# Altium schematic sheet SOLAR CHARGER.SchDoc
size A3; SheetNumber: 1; SheetTotal: 1
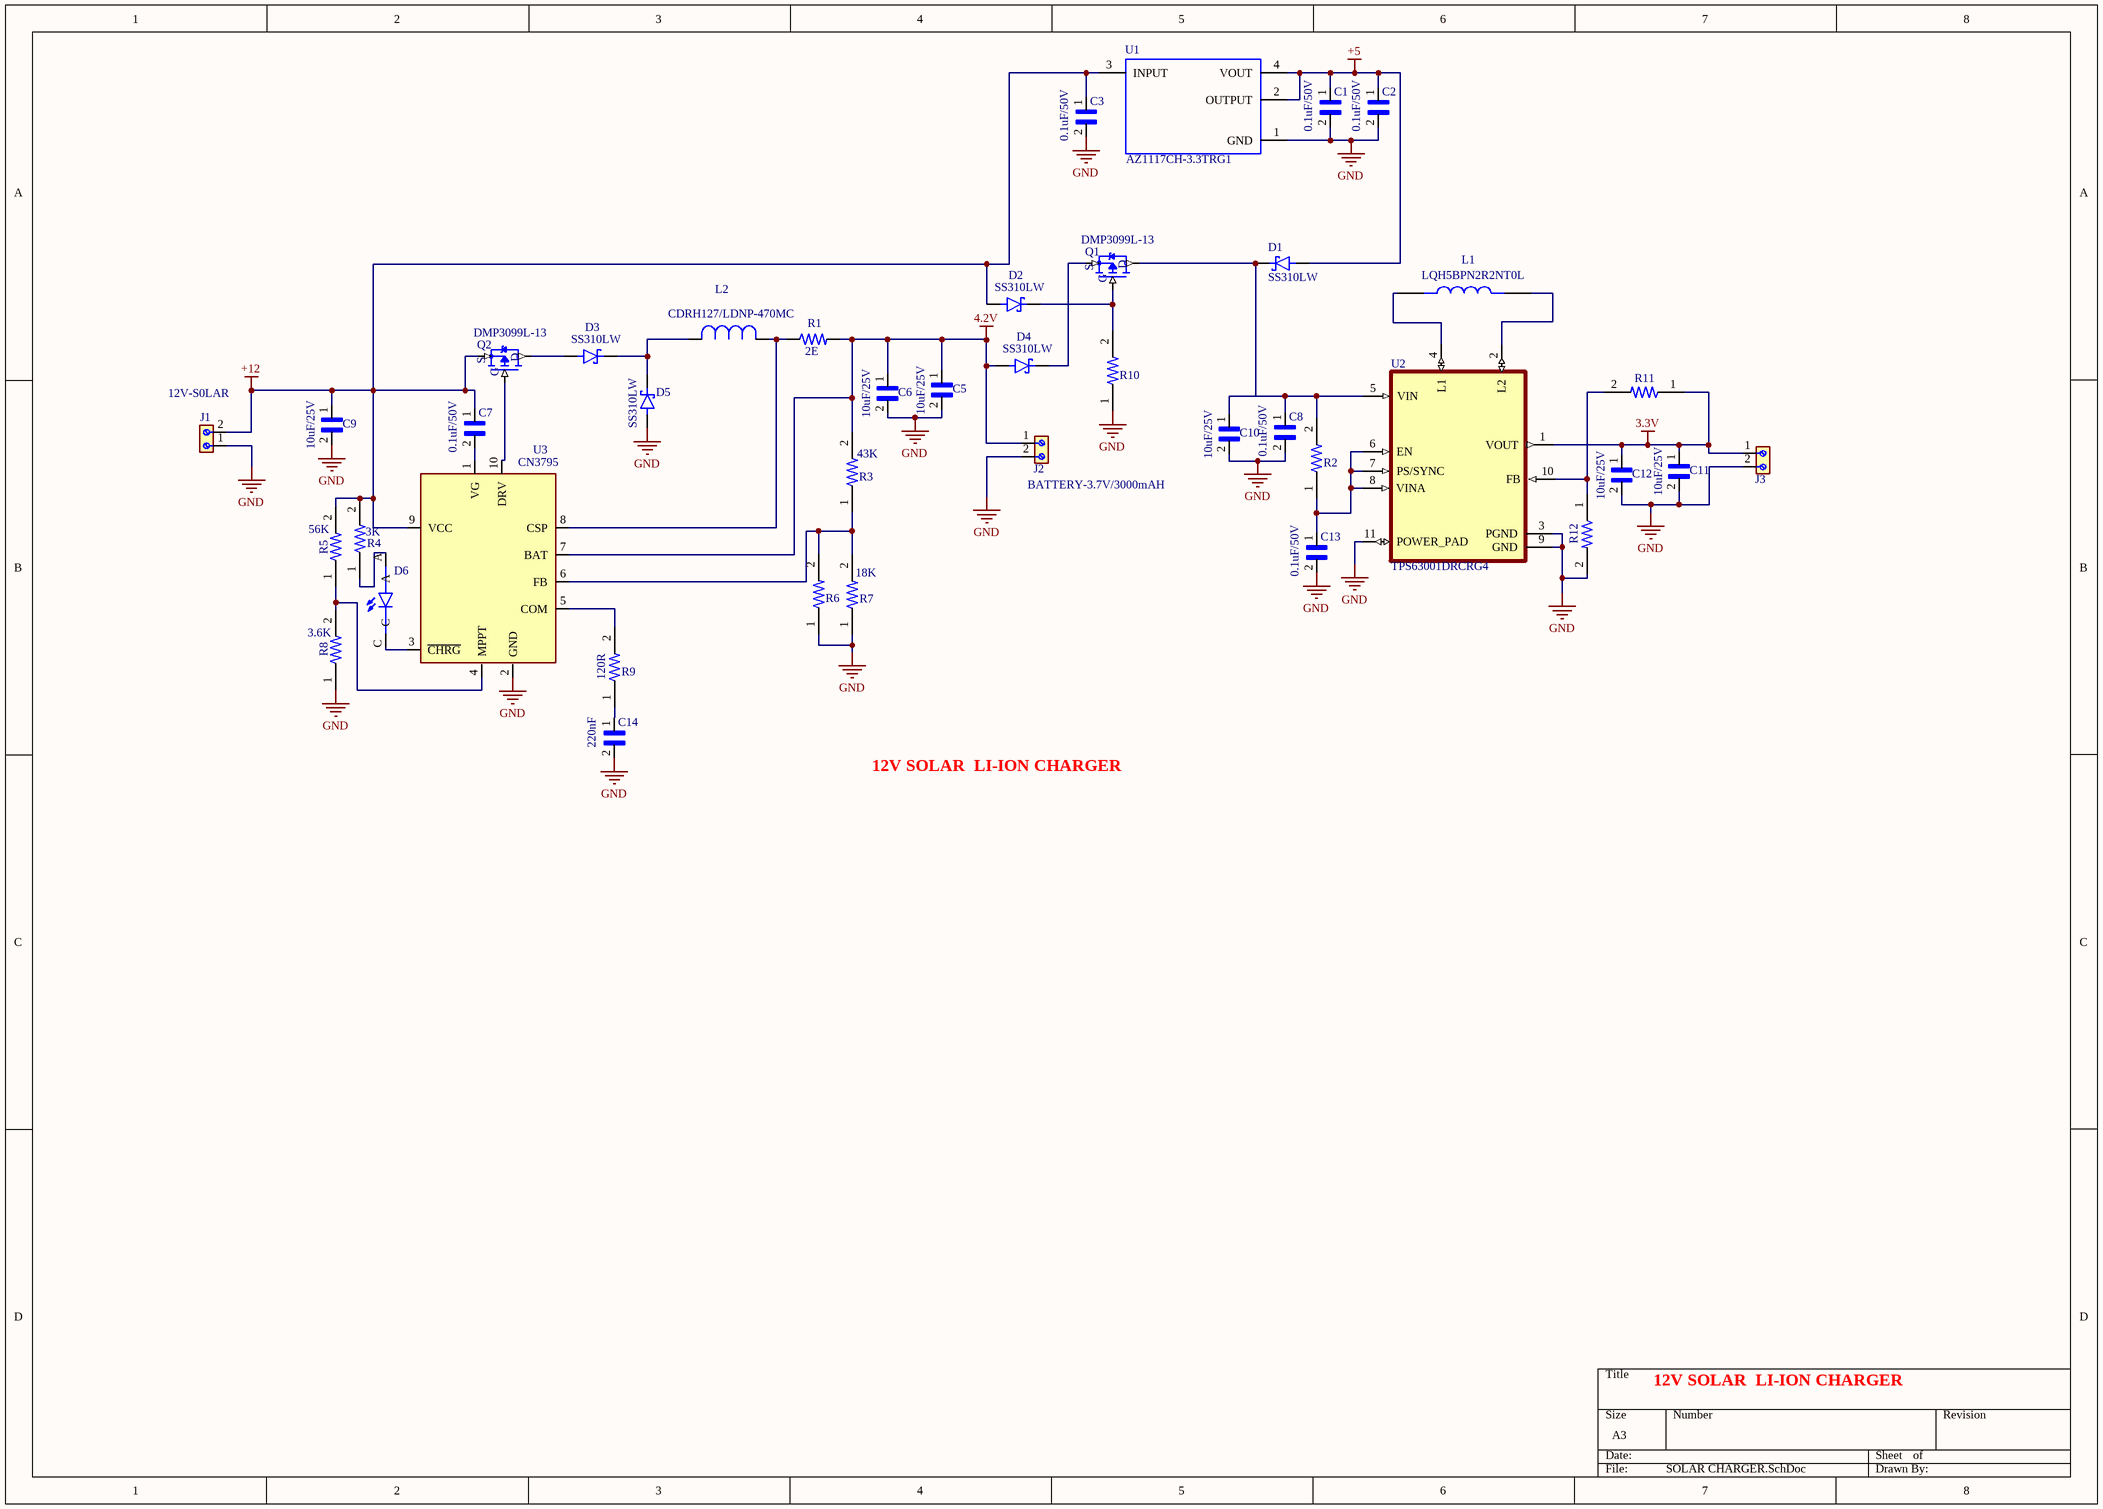
[diagram p0: SOLAR CHARGER.SchDoc]

## Parts
C1  value 0.1uF/50V  [CAPC1608X90]  (hidden comment: CC0603KRX5R5BB106)
C2  value 0.1uF/50V  [CAPC1608X90]  (hidden comment: CC0603KRX5R5BB106)
C3  value 0.1uF/50V  [CAPC1608X90]  (hidden comment: CC0603KRX5R5BB106)
C5  value 10uF/25V  [CAPC1608X100N]  (hidden comment: GRM188R61E106MA73J)
C6  value 10uF/25V  [CAPC1608X100N]  (hidden comment: GRM188R61E106MA73J)
C7  value 0.1uF/50V  [CAPC1608X90]  (hidden comment: CC0603KRX5R5BB106)
C8  value 0.1uF/50V  [CAPC1608X90]  (hidden comment: CC0603KRX5R5BB106)
C9  value 10uF/25V  [CAPC1608X100N]  (hidden comment: GRM188R61E106MA73J)
C10  value 10uF/25V  [CAPC1608X100N]  (hidden comment: GRM188R61E106MA73J)
C11  value 10uF/25V  [CAPC1608X100N]  (hidden comment: GRM188R61E106MA73J)
C12  value 10uF/25V  [CAPC1608X100N]  (hidden comment: GRM188R61E106MA73J)
C13  value 0.1uF/50V  [CAPC1608X90]  (hidden comment: CC0603KRX5R5BB106)
C14  value 220nF  [CAPC1608X90]  (hidden comment: CC0603KRX5R5BB106)
D1  SS310LW  [SODFL3718X102N]
D2  SS310LW  [SODFL3718X102N]
D3  SS310LW  [SODFL3718X102N]
D4  SS310LW  [SODFL3718X102N]
D5  SS310LW  [SODFL3718X102N]
D6  597-3305-607F  [LEDC2012X70N]  (value not drawn)
J1  691210910002  [691210910002]  (value not drawn)
J2  691210910002  [691210910002]  (value not drawn)
J3  691210910002  [691210910002]  (value not drawn)
L1  LQH5BPN2R2NT0L  [IND_LQH5BPN2R2NT0L]
L2  CDRH127/LDNP-470MC  [IND_CDRH127/LDNP-470MC_SUM]
Q1  DMP3099L-13  [SOT95P240X110-3N]
Q2  DMP3099L-13  [SOT95P240X110-3N]
R1  value 2E  [RESC5025X70N]  (hidden comment: 2-2176251-7)
R2  RCWP040210K0FKS3  [RESC1005X40]  (value not drawn)
R3  value 43K  [RESC1005X40]  (hidden comment: RCWP040210K0FKS3)
R4  value 3K  [RESC1005X40]  (hidden comment: RCWP040210K0FKS3)
R5  value 56K  [RESC1005X40]  (hidden comment: RCWP040210K0FKS3)
R6  RCWP040210K0FKS3  [RESC1005X40]  (value not drawn)
R7  value 18K  [RESC1005X40]  (hidden comment: RCWP040210K0FKS3)
R8  value 3.6K  [RESC1005X40]  (hidden comment: RCWP040210K0FKS3)
R9  value 120R  [RESC1005X40]  (hidden comment: RCWP040210K0FKS3)
R10  RCWP040210K0FKS3  [RESC1005X40]  (value not drawn)
R11  RCWP040210K0FKS3  [RESC1005X40]  (value not drawn)
R12  RCWP040210K0FKS3  [RESC1005X40]  (value not drawn)
U1  AZ1117CH-3.3TRG1  [DIODES_AZ1117CH-3.3TRG1_0]  (value not drawn)
U2  TPS63001DRCRG4  [VREG_V62/16624-01YE]
U3  CN3795  [SSOP10]

## Nets
3.3V: C11.1 C12.1 J3.1 R11.1 U2.1(VOUT)
4.2V: C5.1 C6.1 D4.A J2.1 R1.2 R3.2 U3.7(BAT)
+5: C1.1 C2.1 D1.A U1.2(OUTPUT) U1.4(VOUT)
+12: C3.1 C7.1 C9.1 D2.A J1.2 Q2.2(S) R4.2 R5.2 U1.3(INPUT) U3.9(VCC)
GND: C1.2 C2.2 C3.2 C5.2 C6.2 C8.2 C9.2 C10.2 C11.2 C12.2 C13.2 C14.2 D5.A J1.1 J2.2 J3.2 R6.1 R7.1 R8.1 R10.1 R12.2 U1.1(GND) U2.3(PGND) U2.9(GND) U2.11(POWER_PAD) U3.2(GND)
NetC7_2: C7.2 U3.1(VG)
NetC8_1: C8.1 C10.1 R2.2 U2.5(VIN)
NetC13_1: C13.1 R2.1 U2.6(EN) U2.7(PS/SYNC) U2.8(VINA)
NetC14_1: C14.1 R9.1
NetD1_C: D1.C(K) Q1.3(D)
NetD2_C: D2.C(K) Q1.1(G) R10.2
NetD3_A: D3.A Q2.3(D)
NetD3_C: D3.C(K) D5.C(K) L2.2
NetD4_C: D4.C(K) Q1.2(S)
NetD6_A: D6.A R4.1
NetD6_C: D6.C U3.3(~{CHRG})
NetL1_1: L1.1 U2.4(L1)
NetL1_2: L1.2 U2.2(L2)
NetL2_1: L2.1 R1.1 U3.8(CSP)
NetQ2_1: Q2.1(G) U3.10(DRV)
NetR3_1: R3.1 R6.2 R7.2 U3.6(FB)
NetR5_1: R5.1 R8.2 U3.4(MPPT)
NetR9_2: R9.2 U3.5(COM)
NetR11_2: R11.2 R12.1 U2.10(FB)

## Notes on the sheet
- (near J1) 12V-S0LAR
- (near J2) BATTERY-3.7V/3000mAH
- 12V SOLAR  LI-ION CHARGER

## Library data of the parts
C1-C3 C7 C8 C13 C14 = CC0603KRX5R5BB106: 10ÂµF Â±10% 6.3V Ceramic Capacitor X5R 0603 _1608 Metric_; MF: Yageo; MP: CC0603KRX5R5BB106; SnapEDA_Link: https://www.snapeda.com/parts/CC0603KRX5R5BB106/Yageo/view-part/566409/?ref=snap; Package: 0603 Yageo; Digi-Key_Part_Number: 311-1781-1-ND; Digi-Key_Purchase_URL: https://www.digikey.ca/product-detail/en/yageo/CC0603KRX5R5BB106/311-1781-1-ND/5195683?utm_source=snapeda&utm_medium=aggregator&utm_campaign=symbol
C5 C6 C9-C12 = GRM188R61E106MA73J: 0603 10 uF 25 V Â±20% Tolerance X5R Multilayer Ceramic Capacitor; MF: Murata Electronics; Availability: In Stock; SnapEDA_Link: https://www.snapeda.com/parts/GRM188R61E106MA73J/Murata%20Electronics%20North%20America/view-part/1836504/?ref=snap; MP: GRM188R61E106MA73J; Price: None; Package: 1608 Murata; Check_prices: https://www.snapeda.com/parts/GRM188R61E106MA73J/Murata%20Electronics%20North%20America/view-part/1836504/?ref=eda
D1-D5 = SS310LW: 3A, 100V, Schottky Rectifier; MF: Taiwan Semiconductor; Value: *; Check_prices: https://www.snapeda.com/parts/SS310LW/Taiwan+Semiconductor/view-part/?ref=eda; MP: SS310LW; Purchase-URL: https://pricing.snapeda.com/search/part/SS310LW/?ref=eda; SnapEDA_Link: https://www.snapeda.com/parts/SS310LW/Taiwan+Semiconductor/view-part/?ref=snap; Package: SOD-123W-2 Taiwan Semiconductor
D6 = 597-3305-607F: LED Uni-Color Green 4-Pin Chip 0805 T/R; Availability: Unavailable; Value: *; Price: None; MP: 597-3305-607F; Package: None
J1-J3 = 691210910002: 2 Position Wire to Board Terminal Block Horizontal with Board 0.100 (2.54mm) Through Hole; MF: Wurth Electronics; SnapEDA_Link: https://www.snapeda.com/parts/691210910002/Wurth+Electronics/view-part/?ref=snap; Package: None; Value: *; MP: 691210910002; Check_prices: https://www.snapeda.com/parts/691210910002/Wurth+Electronics/view-part/?ref=eda
L1 = LQH5BPN2R2NT0L: Inductor Power Chip Shielded Wirewound 1.2uH 30% 100KHz Ferrite 3.1A 0.0228Ohm DCR 2020 T/R; Package: None; Price: None; Value: *; MP: LQH5BPN2R2NT0L; Availability: Unavailable
L2 = CDRH127/LDNP-470MC: 47 ÂµH Shielded - Inductor 3.25 A 78mOhm Max Nonstandard; MF: Sumida America; SnapEDA_Link: https://www.snapeda.com/parts/CDRH127/LDNP-470MC/Sumida+America+Components+Inc./view-part/?ref=snap; MP: CDRH127/LDNP-470MC; Availability: In Stock; Price: None; Value: *; Check_prices: https://www.snapeda.com/parts/CDRH127/LDNP-470MC/Sumida+America+Components+Inc./view-part/?ref=eda; Package: Nonstandard Sumida; Purchase-URL: https://pricing.snapeda.com/search/part/CDRH127/LDNP-470MC/?ref=eda
Q1 Q2 = DMP3099L-13: P-Channel 30 V 3.8A (Ta) 1.08W (Ta) Surface Mount SOT-23-3; MF: Diodes Inc.; SnapEDA_Link: https://www.snapeda.com/parts/DMP3099L-13/Diodes+Inc./view-part/?ref=snap; Package: SOT-23-3 Diodes Inc.; Value: *; MP: DMP3099L-13; Check_prices: https://www.snapeda.com/parts/DMP3099L-13/Diodes+Inc./view-part/?ref=eda
R1 = 2-2176251-7: CRGS2010J150R - Each; Package: None; Price: None; MP: 2-2176251-7; Availability: Unavailable
R2-R12 = RCWP040210K0FKS3: Res Thick Film 0402 10K Ohm 1% 1/20W Â±100ppm/Â°C Molded SMD SMD T/R; Package: None; Price: None; MP: RCWP040210K0FKS3; Availability: Unavailable
  R2 R6 R10-R12: Value: *
U1 = AZ1117CH-3.3TRG1: Linear Voltage Regulator IC Positive Fixed 1 Output 1A SOT-223-3; MF: Diodes Inc.; SnapEDA_Link: https://www.snapeda.com/parts/AZ1117CH-3.3TRG1/Diodes+Inc./view-part/?ref=snap; Price: None; Check_prices: https://www.snapeda.com/parts/AZ1117CH-3.3TRG1/Diodes+Inc./view-part/?ref=eda; Purchase-URL: https://pricing.snapeda.com/search/part/AZ1117CH-3.3TRG1/?ref=eda; Availability: In Stock; Package: SOT-223 Diodes Inc.; MP: AZ1117CH-3.3TRG1; Value: *
U2 = TPS63001DRCRG4: 96% Buck-Boost Converter with 1.7A Current Switches, 3.3V fixed Output voltage in 3x3 QFN 10-VSON -40 to 85; MF: Texas Instruments; Value: *; SnapEDA_Link: https://www.snapeda.com/parts/TPS63001DRCRG4/Texas+Instruments/view-part/?ref=snap; MP: TPS63001DRCRG4; Purchase-URL: https://pricing.snapeda.com/search/part/TPS63001DRCRG4/?ref=eda; Check_prices: https://www.snapeda.com/parts/TPS63001DRCRG4/Texas+Instruments/view-part/?ref=eda; Availability: In Stock; Price: None; Package: VSON-10 Texas Instruments
U3 = CN3795: 4A, Multi-Chemistry Battery ChargerWith Photovoltaic Cell MPPT Function; MF: Consonance; MP: CN3795; Price: None; SnapEDA_Link: https://www.snapeda.com/parts/CN3795/Consonance/view-part/?ref=snap; Check_prices: https://www.snapeda.com/parts/CN3795/Consonance/view-part/?ref=eda; Package: Package; Availability: Not in stock; Value: *